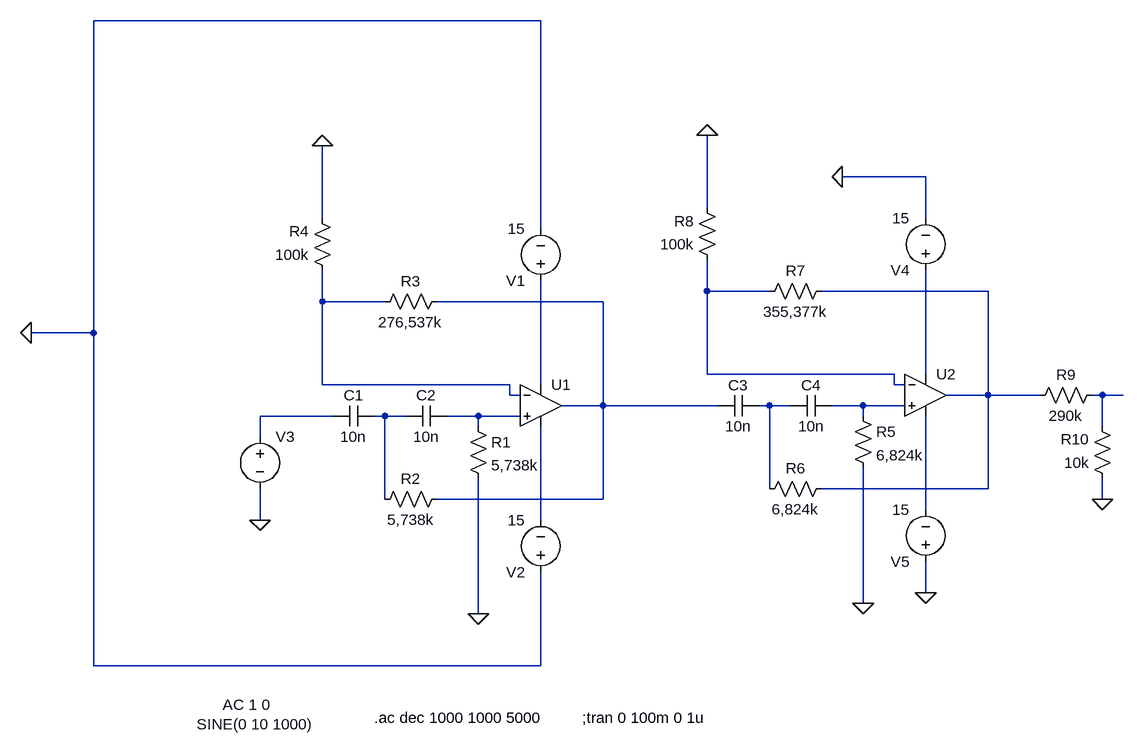
[diagram p0: schematic Passa_alta.asc]
Passa_alta.asc, the LTspice schematic file:
Version 4
SHEET 1 1392 680
WIRE 144 -416 -544 -416
WIRE 736 -176 608 -176
WIRE 400 -128 400 -240
WIRE -192 -112 -192 -224
WIRE 736 -112 736 -176
WIRE 144 -96 144 -416
WIRE 400 0 400 -48
WIRE 496 0 400 0
WIRE 832 0 576 0
WIRE -192 16 -192 -32
WIRE -96 16 -192 16
WIRE 240 16 -16 16
WIRE -544 64 -544 -416
WIRE -544 64 -640 64
WIRE 400 128 400 0
WIRE 688 128 400 128
WIRE 736 128 736 -32
WIRE -192 144 -192 16
WIRE 96 144 -192 144
WIRE 144 144 144 -16
WIRE 688 144 688 128
WIRE 704 144 688 144
WIRE 96 160 96 144
WIRE 112 160 96 160
WIRE 832 160 832 0
WIRE 832 160 768 160
WIRE 912 160 832 160
WIRE 1008 160 992 160
WIRE 1040 160 1008 160
WIRE 240 176 240 16
WIRE 240 176 176 176
WIRE 416 176 240 176
WIRE 496 176 480 176
WIRE 528 176 496 176
WIRE 640 176 592 176
WIRE 704 176 640 176
WIRE -176 192 -288 192
WIRE -96 192 -112 192
WIRE -64 192 -96 192
WIRE 48 192 0 192
WIRE 112 192 48 192
WIRE 640 192 640 176
WIRE 48 208 48 192
WIRE 1008 208 1008 160
WIRE -288 224 -288 192
WIRE 496 304 496 176
WIRE 832 304 832 160
WIRE 832 304 576 304
WIRE -96 320 -96 192
WIRE 240 320 240 176
WIRE 240 320 -16 320
WIRE 1008 320 1008 288
WIRE 736 336 736 192
WIRE -288 352 -288 304
WIRE 144 352 144 208
WIRE 736 464 736 416
WIRE 640 480 640 272
WIRE 48 496 48 288
WIRE -544 576 -544 64
WIRE 144 576 144 432
WIRE 144 576 -544 576
FLAG 48 496 0
FLAG -288 352 0
FLAG -192 -224 0
FLAG 640 480 0
FLAG 608 -176 0
FLAG 736 464 0
FLAG 400 -240 0
FLAG 1008 320 0
FLAG -640 64 0
SYMBOL OpAmps\\UniversalOpAmp 144 176 R0
SYMATTR InstName U1
SYMBOL cap -112 176 R90
WINDOW 0 0 32 VBottom 2
WINDOW 3 32 32 VTop 2
SYMATTR InstName C1
SYMATTR Value 10n
SYMBOL cap 0 176 R90
WINDOW 0 0 32 VBottom 2
WINDOW 3 32 32 VTop 2
SYMATTR InstName C2
SYMATTR Value 10n
SYMBOL res 32 192 R0
SYMATTR InstName R1
SYMATTR Value 5,738k
SYMBOL voltage 144 0 R180
WINDOW 123 0 0 Left 0
WINDOW 39 0 0 Left 0
SYMATTR InstName V1
SYMATTR Value 15
SYMBOL voltage 144 448 R180
WINDOW 123 0 0 Left 0
WINDOW 39 0 0 Left 0
SYMATTR InstName V2
SYMATTR Value 15
SYMBOL voltage -288 208 R0
WINDOW 3 -97 458 Left 2
WINDOW 123 -57 428 Left 2
WINDOW 39 0 0 Left 0
SYMATTR Value SINE(0 10 1000)
SYMATTR Value2 AC 1 0
SYMATTR InstName V3
SYMBOL res 0 304 R90
WINDOW 0 0 56 VBottom 2
WINDOW 3 32 56 VTop 2
SYMATTR InstName R2
SYMATTR Value 5,738k
SYMBOL res 0 0 R90
WINDOW 0 0 56 VBottom 2
WINDOW 3 32 56 VTop 2
SYMATTR InstName R3
SYMATTR Value 276,537k
SYMBOL res -176 -16 R180
WINDOW 0 36 76 Left 2
WINDOW 3 36 40 Left 2
SYMATTR InstName R4
SYMATTR Value 100k
SYMBOL OpAmps\\UniversalOpAmp 736 160 R0
SYMATTR InstName U2
SYMBOL cap 480 160 R90
WINDOW 0 0 32 VBottom 2
WINDOW 3 32 32 VTop 2
SYMATTR InstName C3
SYMATTR Value 10n
SYMBOL cap 592 160 R90
WINDOW 0 0 32 VBottom 2
WINDOW 3 32 32 VTop 2
SYMATTR InstName C4
SYMATTR Value 10n
SYMBOL res 624 176 R0
SYMATTR InstName R5
SYMATTR Value 6,824k
SYMBOL voltage 736 -16 R180
WINDOW 123 0 0 Left 0
WINDOW 39 0 0 Left 0
SYMATTR InstName V4
SYMATTR Value 15
SYMBOL voltage 736 432 R180
WINDOW 123 0 0 Left 0
WINDOW 39 0 0 Left 0
SYMATTR InstName V5
SYMATTR Value 15
SYMBOL res 592 288 R90
WINDOW 0 0 56 VBottom 2
WINDOW 3 32 56 VTop 2
SYMATTR InstName R6
SYMATTR Value 6,824k
SYMBOL res 592 -16 R90
WINDOW 0 0 56 VBottom 2
WINDOW 3 32 56 VTop 2
SYMATTR InstName R7
SYMATTR Value 355,377k
SYMBOL res 416 -32 R180
WINDOW 0 36 76 Left 2
WINDOW 3 36 40 Left 2
SYMATTR InstName R8
SYMATTR Value 100k
SYMBOL res 1008 144 R90
WINDOW 0 0 56 VBottom 2
WINDOW 3 32 56 VTop 2
SYMATTR InstName R9
SYMATTR Value 290k
SYMBOL res 1024 304 R180
WINDOW 0 36 76 Left 2
WINDOW 3 36 40 Left 2
SYMATTR InstName R10
SYMATTR Value 10k
TEXT -112 656 Left 2 !.ac dec 1000 1000 5000
TEXT 208 656 Left 2 !;tran 0 100m 0 1u

The netlist it stands for:
* Passa_alta.asc
XU1 N012 N003 N006 N014 N004 level1 Avol=1Meg GBW=10Meg Vos=0 En=0 Enk=0 In=0 Ink=0 Rin=500Meg  ; pins In+ In- V+ V- OUT
C1 N011 N010 10n
C2 N012 N011 10n
R1 N012 0 5,738k
V1 N006 0 15
V2 0 N014 15
V3 N010 0 SINE(0 10 1000) AC 1 0
R2 N004 N011 5,738k
R3 N004 N003 276,537k
R4 N003 0 100k
XU2 N009 N001 N005 N013 N002 level1 Avol=1Meg GBW=10Meg Vos=0 En=0 Enk=0 In=0 Ink=0 Rin=500Meg  ; pins In+ In- V+ V- OUT
C3 N008 N004 10n
C4 N009 N008 10n
R5 N009 0 6,824k
V4 N005 0 15
V5 0 N013 15
R6 N002 N008 6,824k
R7 N002 N001 355,377k
R8 N001 0 100k
R9 N007 N002 290k
R10 0 N007 10k
.ac dec 1000 1000 5000
;tran 0 100m 0 1u
.lib UniversalOpAmp1.lib
.backanno
.end